# Altium project LittleFOC-pcb-0.0.2.PrjPcb
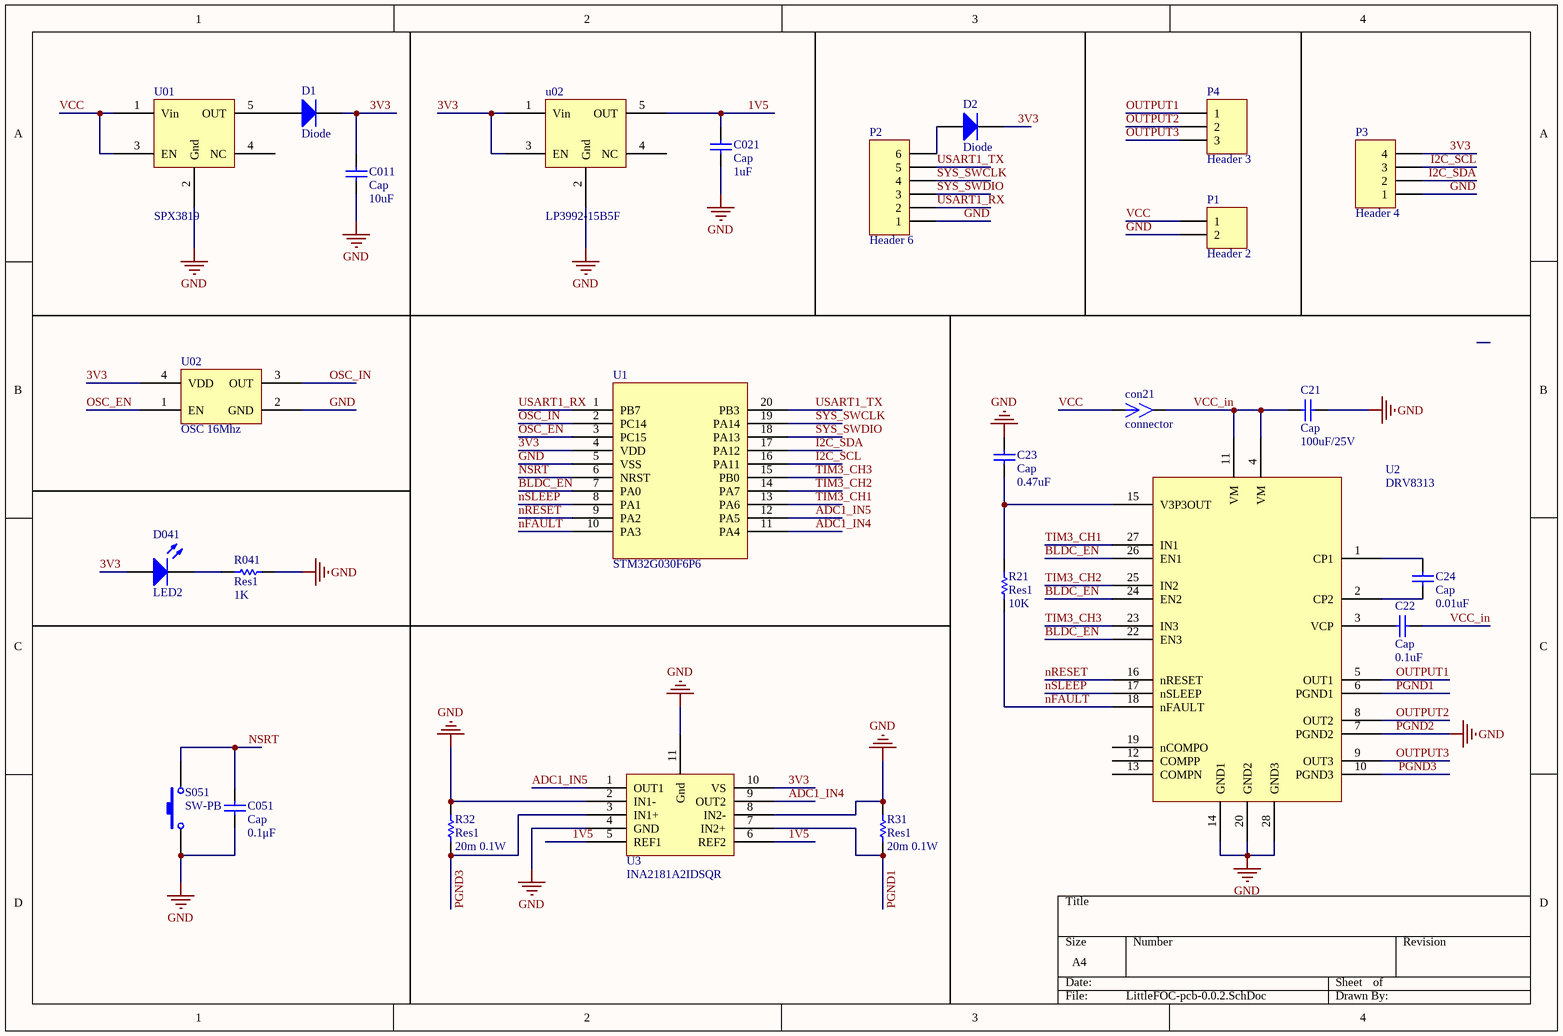
[diagram p0: LittleFOC-pcb-0.0.2.SchDoc]
1 sheet, 26 parts. Net scope: global (net labels, ports and power ports of the same name join across sheets).
Board file: LittleFOC-pcb-0.0.2.PcbDoc

## Sheet LittleFOC-pcb-0.0.2.SchDoc
size A4

### Parts
(Parts that share a designator on the sheet are numbered #1, #2 ... from top to bottom, then left to right.)
C011  Cap  value 10uF  [0402R]
C021  Cap  value 1uF  [0402R]
C21  Cap  value 100uF/25V  [XT_100UF_25V]
C22  Cap  value 0.1uF  [0402R]
C23  Cap  value 0.47uF  [0402R]
C24  Cap  value 0.01uF  [0402R]
C051  Cap  value 0.1μF  [0402R]
con21  connector  [connector]
D1  Diode  [6-0805_M]
D2  Diode  [6-0805_M]
D041  LED2  [0402R]
P1  Header 2  [HDR1X2]
P2  Header 6  [HDR1X6]
P3  Header 4  [HDR1X4]
P4  Header 3  [HDR1X3]
R21  Res1  value 10K  [0402R]
R31  Res1  value 20m 0.1W  [6-0805_M]
R32  Res1  value 20m 0.1W  [6-0805_M]
R041  Res1  value 1K  [0402R]
S051  SW-PB  [MPTCFP2]
U1  STM32G030F6P6  [TSSOP20]
U01  SPX3819  [SOT23-5]
U2  DRV8313  [TSSOP28]
u02#1  LP3992-15B5F  [SOT23-5]
U02#2  OSC 16Mhz  [SMD3225]
U3  INA2181A2IDSQR  [VSSOP-10pin]

### Nets
GND: C011.2 C021.2 C21.2 C23.2 C051.2 P1.2 P2.1 P3.1 R31.2 R32.2 R041.1 S051.1 U01.2(Gnd) U1.5(VSS) U2.7(PGND2) U2.14(GND1) U2.20(GND2) U2.28(GND3) u02#1.2(Gnd) U02#2.2(GND) U3.2(IN1-) U3.4(GND) U3.8(IN2-) U3.11(Gnd)  [also labelled PGND2]
1V5: C021.1 u02#1.5(OUT) U3.5(REF1) U3.6(REF2)
3V3: C011.1 D1.2(K) D2.2(K) D041.1(A) P3.4 U1.4(VDD) u02#1.1(Vin) u02#1.3(EN) U02#2.4(VDD) U3.10(VS)
ADC1_IN4: U1.11(PA4) U3.9(OUT2)
ADC1_IN5: U1.12(PA5) U3.1(OUT1)
BLDC_EN: U1.7(PA0) U2.22(EN3) U2.24(EN2) U2.26(EN1)
I2C_SCL: P3.3 U1.16(PA11)
I2C_SDA: P3.2 U1.17(PA12)
nFAULT: R21.2 U1.10(PA3) U2.18(nFAULT)
nRESET: U1.9(PA2) U2.16(nRESET)
nSLEEP: U1.8(PA1) U2.17(nSLEEP)
NSRT: C051.1 S051.2 U1.6(NRST)
OSC_EN: U1.3(PC15) U02#2.1(EN)
OSC_IN: U1.2(PC14) U02#2.3(OUT)
OUTPUT1: P4.1 U2.5(OUT1)
OUTPUT2: P4.2 U2.8(OUT2)
OUTPUT3: P4.3 U2.9(OUT3)
PGND1: R31.1 U2.6(PGND1) U3.7(IN2+)
PGND3: R32.1 U2.10(PGND3) U3.3(IN1+)
SYS_SWCLK: P2.4 U1.19(PA14)
SYS_SWDIO: P2.3 U1.18(PA13)
TIM3_CH1: U1.13(PA6) U2.27(IN1)
TIM3_CH2: U1.14(PA7) U2.25(IN2)
TIM3_CH3: U1.15(PB0) U2.23(IN3)
USART1_RX: P2.2 U1.1(PB7)
USART1_TX: P2.5 U1.20(PB3)
VCC: con21.1 P1.1 U01.1(Vin) U01.3(EN)
VCC_in: C21.1 C22.1 con21.2 U2.4(VM) U2.11(VM)
NetC22_2: C22.2 U2.3(VCP)
NetC23_1: C23.1 R21.1 U2.15(V3P3OUT)
NetC24_1: C24.1 U2.1(CP1)
NetC24_2: C24.2 U2.2(CP2)
NetD1_1: D1.1(A) U01.5(OUT)
NetD2_1: D2.1(A) P2.6
NetD041_2: D041.2(K) R041.2

Not connected (* = marked no-connect by the designer): U01 4(NC); U2 12(COMPP) 13(COMPN) 19(nCOMPO); u02#1 4(NC)

### Library data of the parts
C011 C021 C21-C24 C051 = Cap Semi: Capacitor (Semiconductor SIM Model); Published: 8-Jun-2000; LatestRevisionDate: 29-May-2009; LatestRevisionNote: IPC-7351 Footprint Added.; PackageReference: C1206; Publisher: Altium Limited; PackageDescription: Chip Capacitor
D1 D2 = Diode: Default Diode; Published: 8-Jun-2000; LatestRevisionDate: 17-Jul-2002; LatestRevisionNote: Re-released for DXP Platform.; PackageVersion: Sep-1996; PackageReference: SMC; Publisher: Altium Limited; PackageDescription: DO-214-AB/SMC; 2 C-Bend Leads; Body 7.9 x 5.9 mm, inc. leads (LxW); Code_JEDEC: DO-214-AB
D041 = LED2: Typical RED, GREEN, YELLOW, AMBER GaAs LED; Published: 8-Jun-2000; LatestRevisionDate: 17-Jul-2002; LatestRevisionNote: Re-released for DXP Platform.; PackageVersion: Feb-2002; PackageReference: 3.2X1.6X1.1; Publisher: Altium Limited; PackageDescription: SM LED; 2 Flat Leads
P1 = Header 2: Header, 2-Pin; LatestRevisionDate: 17-Jul-2002; LatestRevisionNote: Re-released for DXP Platform.; Publisher: Altium Limited
P2 = Header 6: Header, 6-Pin; LatestRevisionDate: 17-Jul-2002; LatestRevisionNote: Re-released for DXP Platform.; Publisher: Altium Limited
P3 = Header 4: Header, 4-Pin; LatestRevisionDate: 17-Jul-2002; LatestRevisionNote: Re-released for DXP Platform.; Publisher: Altium Limited
P4 = Header 3: Header, 3-Pin; LatestRevisionDate: 17-Jul-2002; LatestRevisionNote: Re-released for DXP Platform.; Publisher: Altium Limited
R21 R31 R32 R041 = Res1: Resistor; Published: 8-Jun-2000; LatestRevisionDate: 17-Jul-2002; LatestRevisionNote: Re-released for DXP Platform.; PackageReference: AXIAL-0.3; Publisher: Altium Limited; PackageDescription: Axial Device, Thru-Hole; 2 Leads; 0.3 in Pin Spacing
S051 = SW-PB: Switch; Published: 24-Mar-1999; LatestRevisionDate: 17-Jul-2002; LatestRevisionNote: Re-released for DXP Platform.; PackageReference: SPST-2; Publisher: Altium Limited; PackageDescription: Switch; 2 Leads